# EAGLE design simp1 (EAGLE 9.6.2)
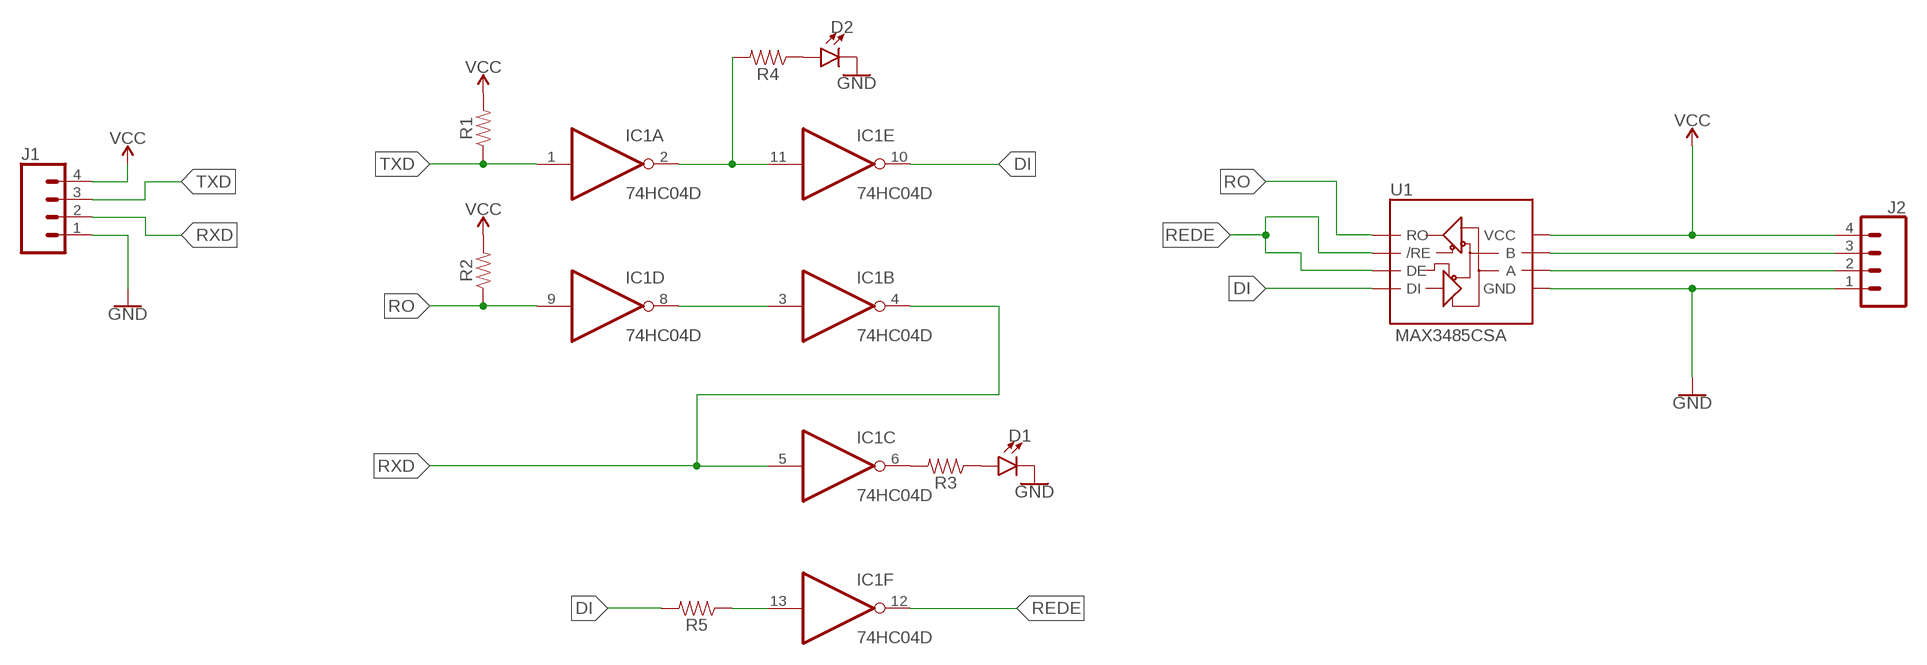
[diagram p0: schematic, sheet 1]

## Parts
D1  LED0603  [LED-0603]
D2  LED0603  [LED-0603]
IC1  74HC04D  [SO14]
J1  CONN_04PTH  [1X04]
J2  CONN_04PTH  [1X04]
R1  RESISTOR0603  [0603]
R2  RESISTOR0603  [0603]
R3  RESISTOR0603  [0603]
R4  RESISTOR0603  [0603]
R5  RESISTOR0603  [0603]
U1  MAX3485CSA  RS485SOIC  [SO08]

## Nets
DI: IC1.10(E:O) R5.2 U1.4(DI)
GND: D1.C D2.C J1.1 J2.1 U1.5(GND)
N$1: IC1.2(A:O) IC1.11(E:I) R4.2
N$2: J2.3 U1.7(B)
N$3: J2.2 U1.6(A)
N$4: IC1.3(B:I) IC1.8(D:O)
N$5: D2.A R4.1
N$6: IC1.6(C:O) R3.2
N$7: D1.A R3.1
N$8: IC1.13(F:I) R5.1
REDE: IC1.12(F:O) U1.2(/RE) U1.3(DE)
RO: IC1.9(D:I) R2.1 U1.1(RO)
RXD: IC1.4(B:O) IC1.5(C:I) J1.2
TXD: IC1.1(A:I) J1.3 R1.1
VCC: J1.4 J2.4 R1.2 R2.2 U1.8(VCC)

## Power pins joined to a net without a drawn wire
GND: IC1.7(P:GND)
VCC: IC1.14(P:VCC)

## Library data of the parts
D1 D2 = SparkFun-LED:LED: LED (Generic) Standard schematic elements and footprints for 5mm, 3mm, 1206, and 0603 sized LEDs. Generic LEDs with no color specified.
IC1 = 74xx-eu:74*04: Hex INVERTER
J1 J2 = SparkFun-Connectors:CONN_04: Multi connection point. Often used as Generic Header-pin footprint for 0.1 inch spaced/style header connections On any of the 0.1 inch spaced packages, you can populate with these: Break Away Headers - Straight <https://www.sparkfun.com/products/116> (PRT-00116) Break Away Male Headers - Right Angle <https://www.sparkfun.com/products/553> (PRT-00553) Female Headers <https://www.sparkfun.com/products/115> (PRT-00115) Break Away Headers - Machine Pin <https://www.sparkfun.com/products/117> (PRT-00117) Break Away Female Headers - Swiss Machine Pin <https://www.sparkfun.com/products/743> (PRT-00743) For SCREWTERMINALS and SPRING TERMINALS visit here: Screw Terimnals on SparkFun.com <https://www.sparkfun.com/search/results?term=Screw+Terminals> (5mm/3.5mm/2.54mm spacing) This device is also useful as a general connection point to wire up your design to another part of your project. Our various solder wires solder well into these plated through hole pads. Hook-Up Wire - Assortment (Stranded, 22 AWG) <https://www.sparkfun.com/products/11375> (PRT-11375) Hook-Up Wire - Assortment (Solid Core, 22 AWG) <https://www.sparkfun.com/products/11367> (PRT-11367) View the entire wire category on our website here <https://www.sparkfun.com/categories/141> Special notes: Molex polarized connector foot print use with SKU : PRT-08231 with associated crimp pins and housings. 1MM SMD Version SKU: PRT-10208; PROD_ID: CONN-09696
R1-R5 = SparkFun-Resistors:RESISTOR: Generic Resistor Package
U1 = SparkFun-IC-Comms:RS485: RS-485 Transceiver SP3485 Series 8 Pin NSOIC 3.3 V Low Power Half Duplex RS-485 Transceiver MAX3485 compatible Datasheet <http://www.sparkfun.com/datasheets/Components/General/sp3485CN-LTR.pdf> SparkFun Products SparkFun Transceiver Breakout - RS-485 <https://www.sparkfun.com/products/10124> (BOB-10124) SparkFun USB to RS-485 Converter <https://www.sparkfun.com/products/9822> (BOB-09822); PROD_ID: IC-09388

## Board
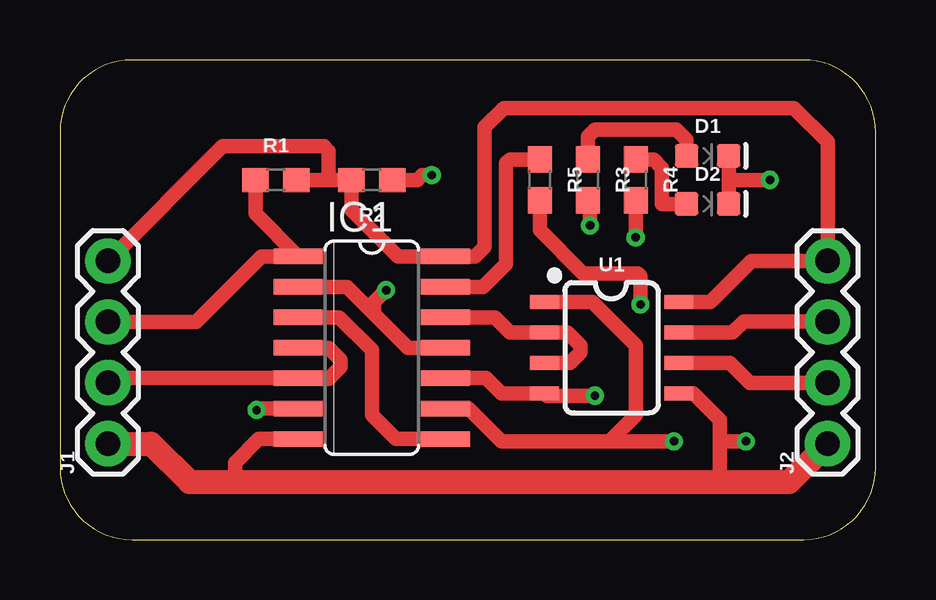
[diagram p1: board, top side]
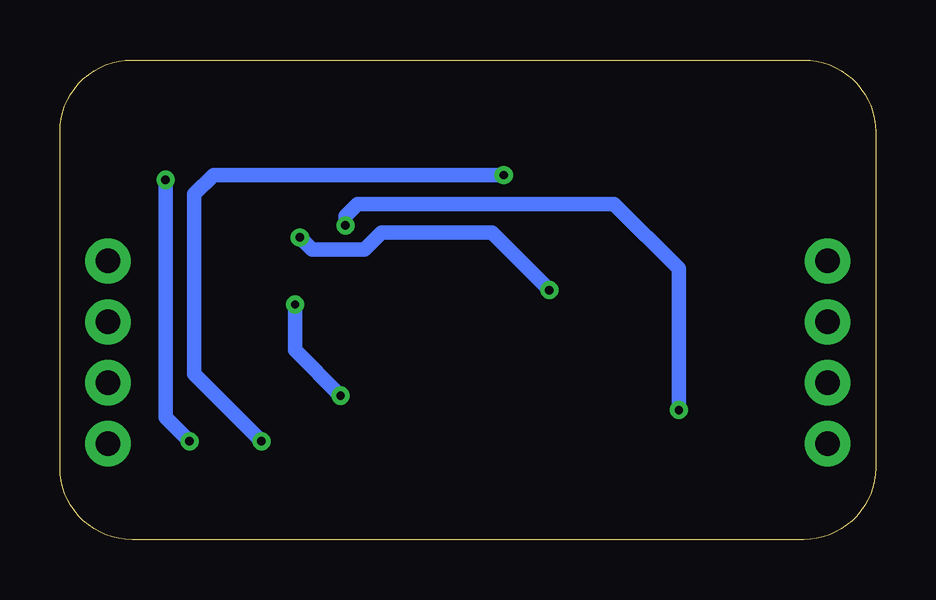
[diagram p2: board, bottom side, seen from below]

Size 34 x 20 mm. Coordinates in mm from the lower left corner, seen from the top.
Outline: 0,17 0,3 arc90 3,0 31,0 arc90 34,3 34,17 arc90 31,20 3,20 arc90 0,17
Copper layers (1*16): Top 0.035mm / dielectric 1.5mm / Bottom 0.035mm
Design rules "default *": minimum track width 6mil, minimum drill 0.35mm, track to track 6mil, track to pad 6mil, pad to pad 6mil, via to via 6mil, smd to smd 6mil, copper to edge 40mil, drill to drill 6mil, minimum pad ring 10mil, minimum via ring 8mil, stop-mask expansion 4mil, vias tented up to drill 24mil, thermal gap 10mil

### Footprints (pad centres in the part's own frame; a part is rotated, then mirrored left to right if it is on the bottom)
LED-0603 = smd 1 x 1: A -0.877,0; C 0.877,0
SO14 = smd 0.66 x 2.032: 1 -3.81,-3.073; 2 -2.54,-3.073; 3 -1.27,-3.073; 4 0,-3.073; 5 1.27,-3.073; 6 2.54,-3.073; 7 3.81,-3.073; 8 3.81,3.073; 9 2.54,3.073; 10 1.27,3.073; 11 0,3.073; 12 -1.27,3.073; 13 -2.54,3.073; 14 -3.81,3.073
1X04 = drill 1.016 pad 1.88: 1 0,0; 2 2.54,0; 3 5.08,0; 4 7.62,0
0603 = smd 1.1 x 1: 1 -0.85,0; 2 0.85,0
SO08 = smd 0.6 x 1.2: 1 -1.905,-2.8; 2 -0.635,-2.8; 3 0.635,-2.8; 4 1.905,-2.8; 5 1.905,2.8; 6 0.635,2.8; 7 -0.635,2.8; 8 -1.905,2.8

### Placement (x,y rotation side)
D1  27,16 0 top
D2  27,14 0 top
IC1  13,8 270 top
J1  2,4 90 top
J2  32,4 90 top
R1  9,15 0 top
R2  13,15 180 top
R3  22,15 270 top
R4  24,15 270 top
R5  20,15 270 top
U1  23,8 270 top

### Tracks (layer width: path | path; a pad name or v marks a point on that pad's centre or on a via)
DI  (via drill 0.35)
  Top 0.6: IC1.10 17.77,6.73 18.41,6.09 U1.4 20.3,6 v22.3,6 | R5.2 20,12.9 21.8,11.1 24.1,11.1 24.2,11 v24.2,9.8
  Bottom 0.6: v24.2,9.8 24.2,7.9 v22.3,6
GND  (via drill 0.35)
  Top 0.6: IC1.7 8.29,4.19 7.3,3.2 7.3,2.4 | U1.5 26.41,6.09 27.5,5 27.5,4.1 | 27.5,4.1 27.5,2.4 | D1.C 27.88,15 | 27.88,15 D2.C | 27.88,15 v29.6,15 | v28.6,4.1 27.5,4.1
  Top 1: J1.1 3.8,4 5.4,2.4 7.3,2.4 27.5,2.4 30.4,2.4 J2.1
  Bottom 0.6: v29.6,15 29.6,5.1 v28.6,4.1
N$1  (via drill 0.35)
  Top 0.6: IC1.2 11.96,10.54 13.1,9.4 | IC1.11 14.5,8 13.1,9.4 | 13.1,9.4 13.1,9.9 v13.6,10.4 | v24,12.6 R4.2
  Bottom 0.6: v13.6,10.4 16,12.8 20.6,12.8 21.3,12.1 23.5,12.1 v24,12.6
N$2
  Top 0.6: U1.7 28.04,8.63 28.5,9.1 31.98,9.1 J2.3
N$3
  Top 0.6: U1.6 27.93,7.37 28.76,6.54 J2.2
N$4
  Top 0.6: IC1.3 11.63,9.27 13,7.9 13,5.2 14,4.2 IC1.8
N$5
  Top 0.6: R4.1 24.75,15.85 25.1,15.5 25.1,14 D2.A
N$6  (via drill 0.35)
  Top 0.6: IC1.6 8.26,5.46 v8.2,5.4 | v22.1,13.1 22.1,14.05 R3.2
  Bottom 0.6: v8.2,5.4 8.2,11.3 10.9,14 21.6,14 22.1,13.5 v22.1,13.1
N$7
  Top 0.6: R3.1 22,16.8 22.3,17.1 25.7,17.1 26.12,16.68 D1.A
N$8
  Top 0.6: IC1.13 17.64,10.54 18.6,11.5 18.6,15.7 18.75,15.85 R5.1
REDE
  Top 0.6: IC1.12 18.13,9.27 18.77,8.63 U1.2 21.16,8.63 21.7,8.1 21.7,7.8 21.27,7.37 U1.3
RO  (via drill 0.35)
  Top 0.6: IC1.9 17.04,5.46 18.4,4.1 22.9,4.1 | 22.9,4.1 24,5.2 24,8.1 22.2,9.9 U1.1 | R2.1 14.9,15 15.1,15.2 v15.5,15.2 | v25.6,4.1 22.9,4.1
  Bottom 0.6: v15.5,15.2 27.6,15.2 28.4,14.4 28.4,6.9 v25.6,4.1
RXD
  Top 0.6: J1.2 2.19,6.73 IC1.5 9.96,6.7 11.2,6.7 11.7,7.2 11.7,7.5 11.2,8 IC1.4
TXD
  Top 0.6: J1.3 5.68,9.08 8.41,11.81 IC1.1 8.15,13.59 R1.1
VCC
  Top 0.6: U1.8 27.11,9.9 28.82,11.62 J2.4 32,16.6 30.6,18 18.5,18 17.7,17.2 17.7,12.2 17.31,11.81 IC1.14 14.09,11.81 12.15,13.75 R2.2 11.2,15 | R1.2 11.2,15 | J1.4 6.78,16.4 11,16.4 11.2,16.2 11.2,15